# Altium schematic sheet Mcu1.SchDoc
size A; Organization: Altium Limited; Address1: L3, 12a Rodborough Rd; Address2: Frenchs Forest; Address3: NSW; Address4: Australia 2086; DocumentNumber: 2; SheetNumber: 2; SheetTotal: 2
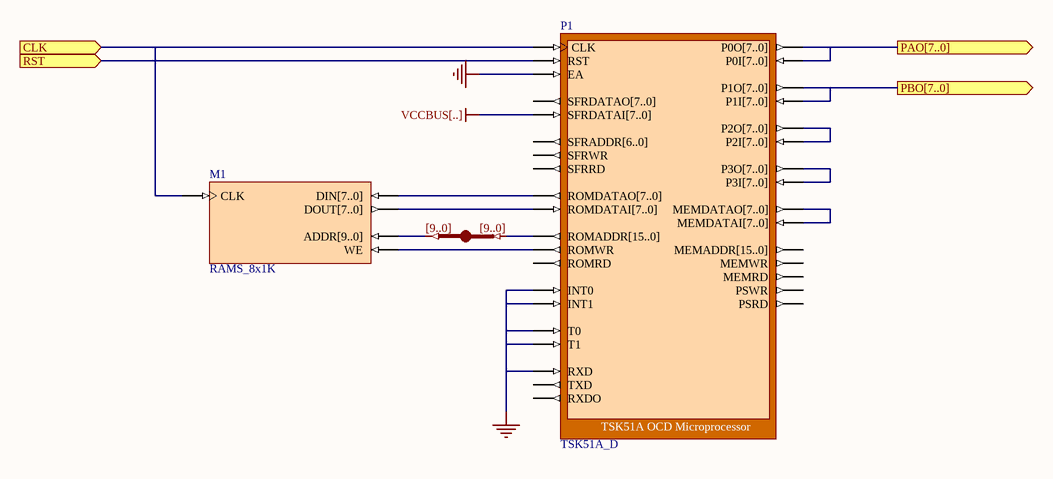
[diagram p0: Mcu1.SchDoc]

## Parts
M1  RAMS_8x1K
P1  TSK51A_D
U9  IndexA: [9..0]  (hidden comment: JB)

## Ports
CLK (in), PAO[7..0] (out), PBO[7..0] (out), RST (in)

## Nets
GND: P1.EA P1.INT0 P1.INT1 P1.RXD P1.T0 P1.T1
VCCBUS[..]: P1.SFRDATAI[7..0]
CLK: M1.CLK P1.CLK ; port CLK
PAO[7..0]: P1.P0I[7..0] P1.P0O[7..0] ; port PAO[7..0]
PBO[7..0]: P1.P1I[7..0] P1.P1O[7..0] ; port PBO[7..0]
RST: P1.RST ; port RST
NetM1_ADDR[9..0]: M1.ADDR[9..0] U9.B[0..0]
NetM1_DIN[7..0]: M1.DIN[7..0] P1.ROMDATAO[7..0]
NetM1_DOUT[7..0]: M1.DOUT[7..0] P1.ROMDATAI[7..0]
NetM1_WE: M1.WE P1.ROMWR
NetP1_MEMDATAI[7..0]: P1.MEMDATAI[7..0] P1.MEMDATAO[7..0]
NetP1_P2I[7..0]: P1.P2I[7..0] P1.P2O[7..0]
NetP1_P3I[7..0]: P1.P3I[7..0] P1.P3O[7..0]
NetP1_ROMADDR[15..0]: P1.ROMADDR[15..0] U9.A[0..0]

Not connected (* = marked no-connect by the designer): P1 MEMADDR[15..0] MEMRD MEMWR PSRD PSWR ROMRD RXDO SFRADDR[6..0] SFRDATAO[7..0] SFRRD SFRWR TXD

## Notes on the sheet
- Title
- Size:
- Date:
- A
- Number:
- Time:
- Revision:
- Sheet
- of
- File:

## Library data of the parts
M1 = RAMS_8x1K: Single Port Random Access Memory; Memory_Depth: 1024; Memory_Type: RAM_SinglePortBlock; Memory_Width: 8; Memory_ClockEdge: Rising; Nexus_Core: Memory_Program; Published: 13/01/2004; Publisher: Altium Hobart Technology Center
P1 = TSK51A_D: TSK51A OCD Microprocessor; NEXUS_CORE: Processor_OCDS; NEXUS_JTAG_DEVICE: True; NEXUS_JTAG_ORDER: 0; ChildModel1: RAM256x8_TSK51D; ChildCore1: M1; Published: 10/11/2003; Publisher: Altium Hobart Technology Centre; Core Revision: 1.00.00
U9 = JB: System BUS Joiner; ArchiveName: GENERIC; Published: 18-Dec-2003; Publisher: Altium Limited; Core Revision: 1.00.00; IndexB: [9..0]